# EAGLE design audio_V1 (EAGLE 9.6.2)
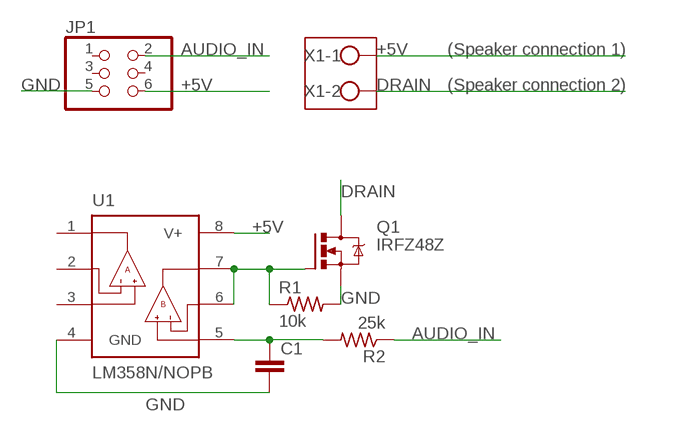
[diagram p0: schematic, sheet 1]

## Parts
C1  C-EU025-025X050  [C025-025X050]
JP1  PINHD-2X3  [2X03]
Q1  IRFZ48Z  [TO220BH]
R1  10k  R-US_0204/7  [0204/7]
R2  25k  R-US_0204/7  [0204/7]
U1  LM358N/NOPB  [DIP794W45P254L959H508Q8]
X1  W237-102  [W237-102]

## Nets
+5V: JP1.6 U1.8(V+) X1.1
AUDIO_IN: JP1.2 R2.1
DRAIN: Q1.D X1.2
GND: C1.2 JP1.5 Q1.S R1.2 U1.4(GND)
N$2: C1.1 R2.2 U1.5(+INB)
N$4: Q1.G R1.1 U1.6(-INB) U1.7(OUTB)
Unconnected: JP1.1 JP1.3 JP1.4 U1.1(OUTA) U1.2(-INA) U1.3(+INA)

## Notes on the sheet
- (Speaker connection 1)
- (Speaker connection 2)

## Library data of the parts
C1 = rcl:C-EU: CAPACITOR, European symbol; SPICEPREFIX: C
JP1 = pinhead:PINHD-2X3: PIN HEADER
Q1 = transistor-power:IRFZ48: N Channel HEXFET® Power MOSFET Logic Level Source: http://www.irf.com/product-info/datasheets/data/irfz48z.pdf
R1 R2 = rcl:R-US_: RESISTOR, American symbol; SPICEPREFIX: R
U1 = LM358N_NOPB:LM358N/NOPB: Check prices <https://snapeda.com/parts/LM358N/NOPB/Texas%20Instruments/view-part/?ref=eda> Check prices <https://pricing.snapeda.com/parts/LM358N/ON%20Semiconductor/view-part?ref=eda>; AVAILABILITY: In Stock; DESCRIPTION: General Purpose Amplifier 2 Circuit - 8-PDIP; MF: ON Semiconductor; MP: LM358N; PACKAGE: DIP-8 HTC Korea; PRICE: None
X1 = con-wago-500:W237-102: WAGO SCREW CLAMP; MPN: 237-102; OC_FARNELL: unknown; OC_NEWARK: 70K9898

## Board
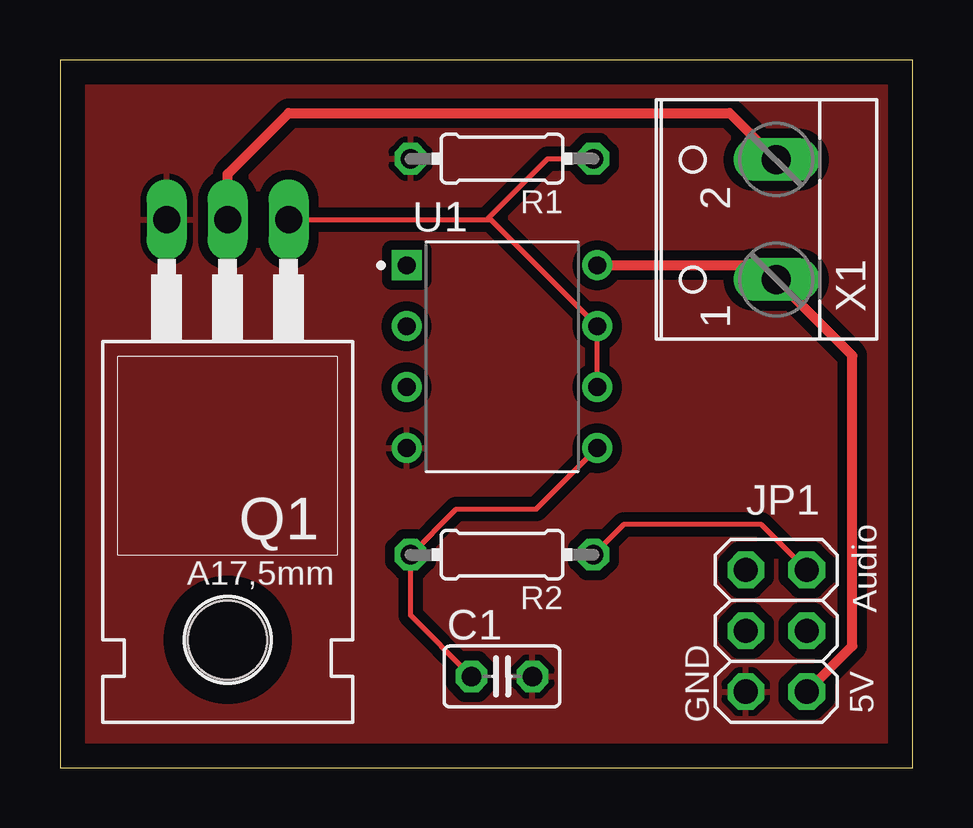
[diagram p1: board, top side]
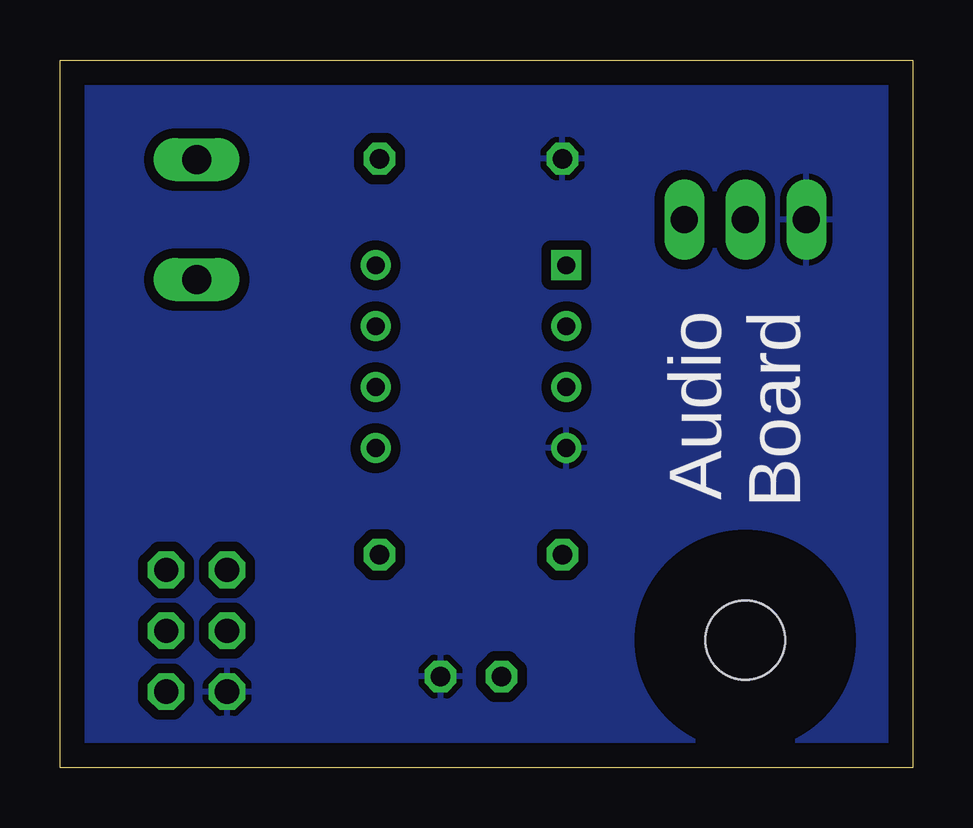
[diagram p2: board, bottom side, seen from below]

Size 35.54 x 29.52 mm. Coordinates in mm from the lower left corner, seen from the top.
Outline: 0,0 35.54,0 35.54,29.52 0,29.52 0,0
Copper layers (1*16): Top 0.035mm / dielectric 1.5mm / Bottom 0.035mm
Design rules "default": minimum track width 6mil, minimum drill 0.35mm, track to track 6mil, track to pad 6mil, pad to pad 6mil, via to via 6mil, smd to smd 6mil, copper to edge 40mil, drill to drill 6mil, minimum pad ring 10mil, minimum via ring 8mil, stop-mask expansion 4mil, vias tented up to drill 0mil, thermal gap 10mil

### Footprints (pad centres in the part's own frame; a part is rotated, then mirrored left to right if it is on the bottom)
C025-025X050 = drill 0.813 octagon: 1 -1.27,0; 2 1.27,0
2X03 = drill 1.016 octagon: 1 -2.54,-1.27; 2 -2.54,1.27; 3 0,-1.27; 4 0,1.27; 5 2.54,-1.27; 6 2.54,1.27
TO220BH = drill 1.118 long: D 0,-6.35; G -2.54,-6.35; S 2.54,-6.35 | hole 3.302: 0,11.176
0204/7 = drill 0.813 octagon: 1 -3.81,0; 2 3.81,0
DIP794W45P254L959H508Q8 = drill 0.74 pad 1.13 square: 1 -3.97,3.81 | drill 0.74 pad 1.13: 2 -3.97,1.27; 3 -3.97,-1.27; 4 -3.97,-3.81; 5 3.97,-3.81; 6 3.97,-1.27; 7 3.97,1.27; 8 3.97,3.81
W237-102 = drill 1.194 long: 1 -2.5,-1.27; 2 2.5,-1.27

### Placement (x,y rotation side)
C1  18.41,3.81 0 top
JP1  29.84,5.71 270 top
Q1  6.99,16.51 180 top
R1  18.41,25.4 180 top
R2  18.41,8.89 180 top
U1  18.41,17.14 0 top
X1  28.58,22.86 90 top

### Tracks (layer width: path | path; a pad name or v marks a point on that pad's centre or on a via)
+5V
  Top 0.406: JP1.6 33.02,5.08 33.02,17.18 29.87,20.34 X1.1 29.25,20.95 U1.8
AUDIO_IN
  Top 0.203: JP1.2 29.21,10.16 23.5,10.16 R2.1
DRAIN
  Top 0.406: Q1.D 6.99,24.77 9.53,27.3 27.9,27.3 X1.2
GND
  pour Top (isolate 0.406): 0,0 0,29.84 36.2,29.84 36.2,0
  pour Bottom (isolate 0.406): 0,0 0,29.84 36.2,29.84 36.2,0
N$2
  Top 0.203: U1.5 19.84,10.79 16.51,10.79 R2.2 14.61,6.35 C1.1
N$4
  Top 0.203: U1.6 U1.7 17.94,22.86 17.78,22.86 | Q1.G 17.78,22.86 | 17.78,22.86 20.32,25.4 R1.1

### Text on the board
tPlace: Audio | GND | 5V
bPlace: Audio / Board